# Altium project Final_Project_Layout.PrjPcb
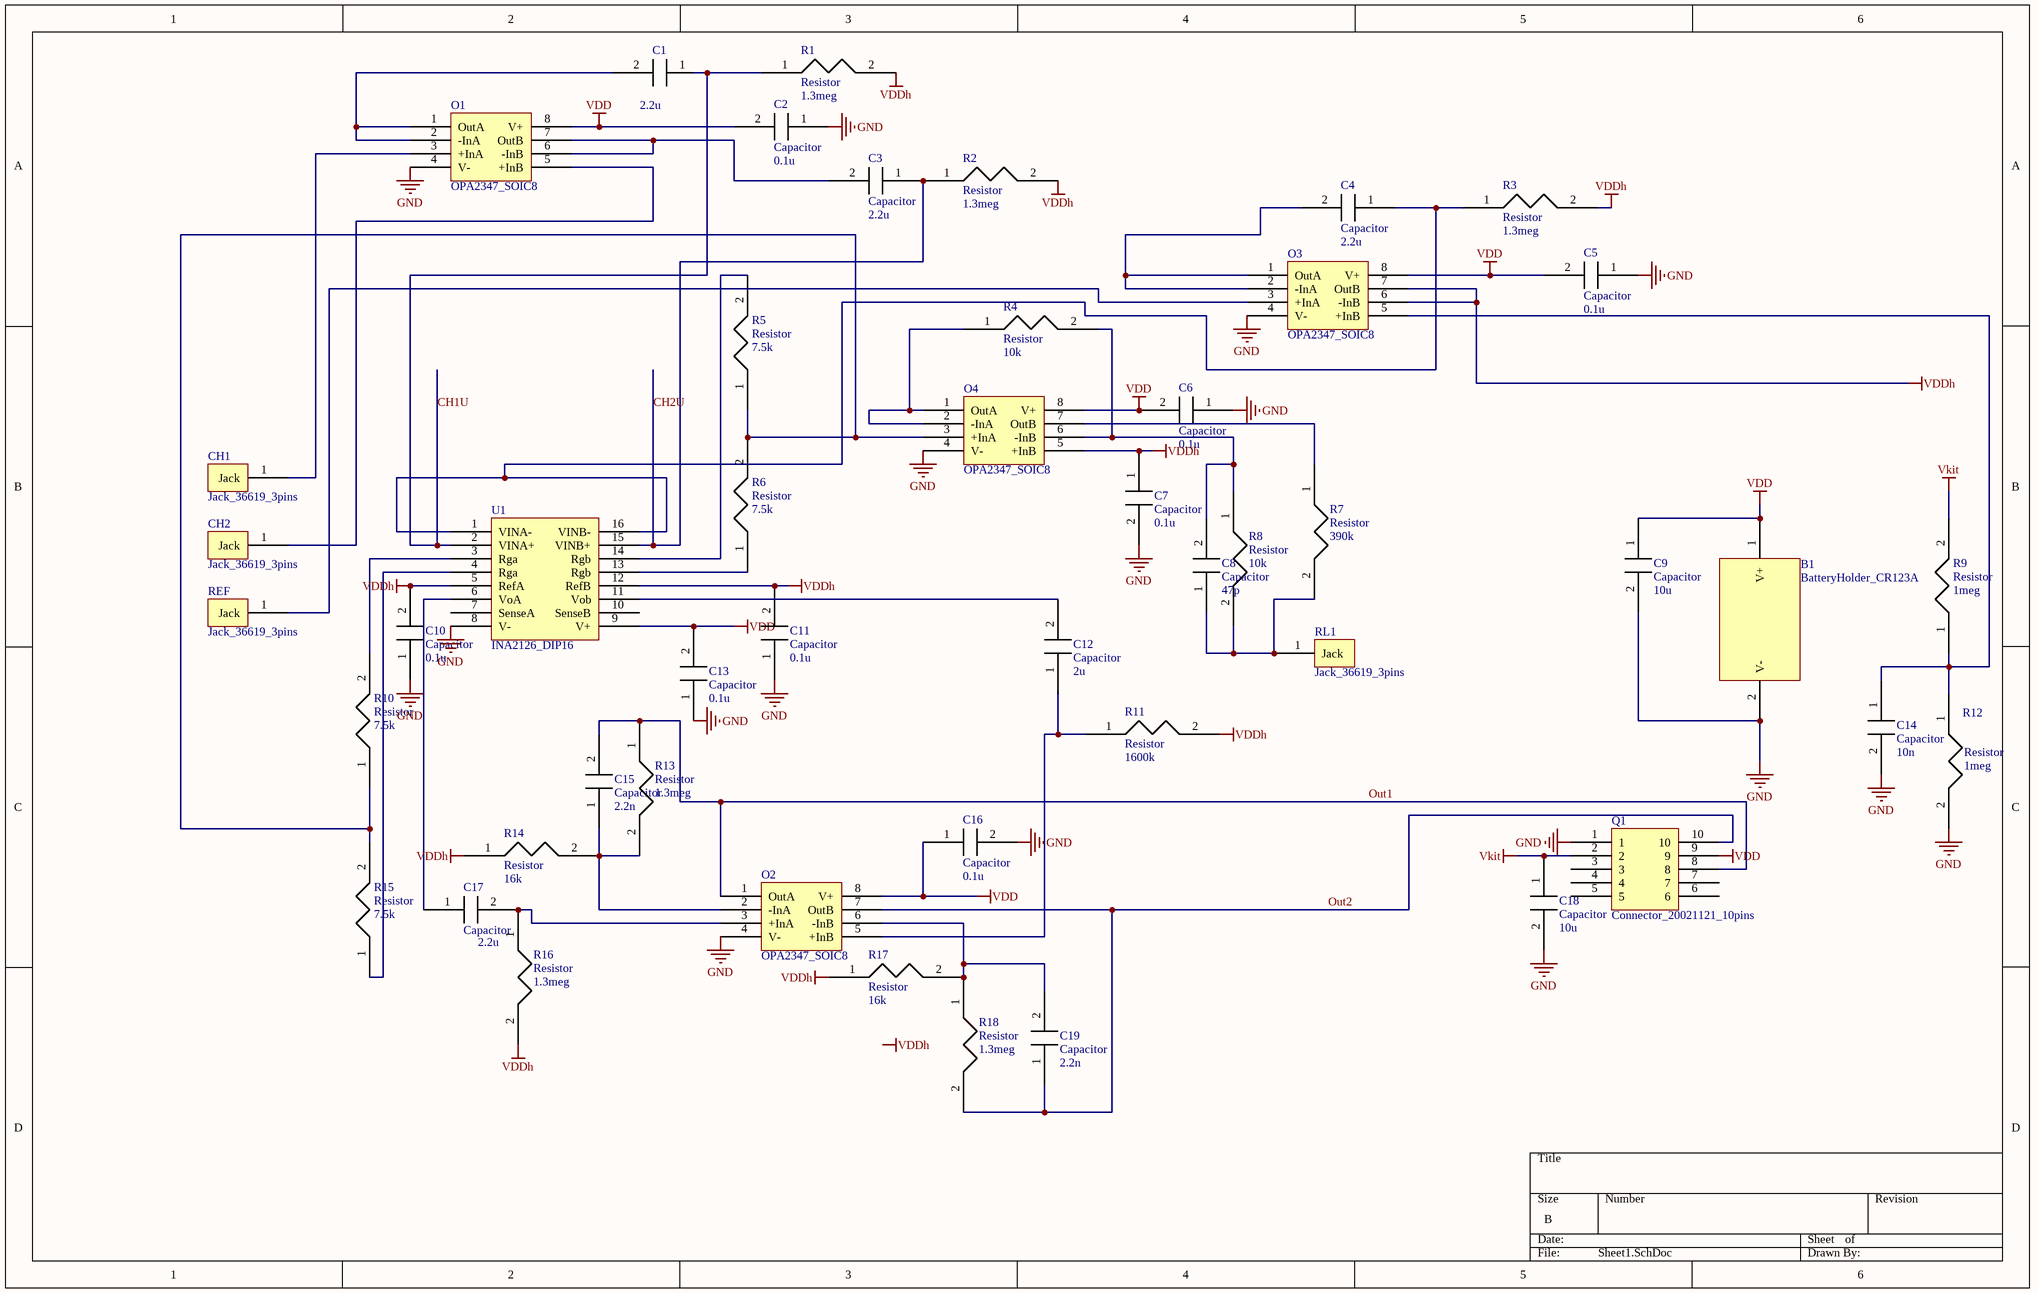
[diagram p0: Sheet1.SchDoc]
1 sheet, 48 parts. Net scope: global (net labels, ports and power ports of the same name join across sheets).
Board file: PCB3.PcbDoc

## Sheet Sheet1.SchDoc
size B

### Parts
B1  BatteryHolder_CR123A  [BatterHolder_CR123A]
C1  value 2.2u  [Capacitor]  (hidden comment: Capacitor)
C2  Capacitor  value 0.1u  [Capacitor]
C3  Capacitor  value 2.2u  [Capacitor]
C4  Capacitor  value 2.2u  [Capacitor]
C5  Capacitor  value 0.1u  [Capacitor]
C6  Capacitor  value 0.1u  [Capacitor]
C7  Capacitor  value 0.1u  [Capacitor]
C8  Capacitor  value 47p  [Capacitor]
C9  Capacitor  value 10u  [Capacitor]
C10  Capacitor  value 0.1u  [Capacitor]
C11  Capacitor  value 0.1u  [Capacitor]
C12  Capacitor  value 2u  [Capacitor]
C13  Capacitor  value 0.1u  [Capacitor]
C14  Capacitor  value 10n  [Capacitor]
C15  Capacitor  value 2.2n  [Capacitor]
C16  Capacitor  value 0.1u  [Capacitor]
C17  Capacitor  value 2.2u  [Capacitor]
C18  Capacitor  value 10u  [Capacitor]
C19  Capacitor  value 2.2n  [Capacitor]
CH1  Jack_36619_3pins  [Jack_36619_3pads]
CH2  Jack_36619_3pins  [Jack_36619_3pads]
O1  OPA2347_SOIC8  [OPA2347P_SOIC8]
O2  OPA2347_SOIC8  [OPA2347P_SOIC8]
O3  OPA2347_SOIC8  [OPA2347P_SOIC8]
O4  OPA2347_SOIC8  [OPA2347P_SOIC8]
Q1  Connector_20021121_10pins  [20021121-10pins]
R1  Resistor  value 1.3meg  [Resisitor]
R2  Resistor  value 1.3meg  [Resisitor]
R3  Resistor  value 1.3meg  [Resisitor]
R4  Resistor  value 10k  [Resisitor]
R5  Resistor  value 7.5k  [Resisitor]
R6  Resistor  value 7.5k  [Resisitor]
R7  Resistor  value 390k  [Resisitor]
R8  Resistor  value 10k  [Resisitor]
R9  Resistor  value 1meg  [Resisitor]
R10  Resistor  value 7.5k  [Resisitor]
R11  Resistor  value 1600k  [Resisitor]
R12  Resistor  value 1meg  [Resisitor]
R13  Resistor  value 1.3meg  [Resisitor]
R14  Resistor  value 16k  [Resisitor]
R15  Resistor  value 7.5k  [Resisitor]
R16  Resistor  value 1.3meg  [Resisitor]
R17  Resistor  value 16k  [Resisitor]
R18  Resistor  value 1.3meg  [Resisitor]
REF  Jack_36619_3pins  [Jack_36619_3pads]
RL1  Jack_36619_3pins  [Jack_36619_3pads]
U1  INA2126_DIP16  [INA2126_DIP16]

### Nets
GND: B1.2(V-) C2.1(V-) C5.1(V-) C6.1(V-) C7.2(V-) C9.2(V-) C10.1(V-) C11.1(V-) C13.1(V-) C14.2(V-) C16.2(V-) C18.2(V-) O1.4(V-) O2.4(V-) O3.4(V-) O4.4(V-) Q1.1 R12.2(V-) U1.8(V-)
VDD: B1.1(V+) C2.2(V-) C5.2(V-) C6.2(V-) C9.1(V-) C13.2(V-) C16.1(V-) O1.8(V+) O2.8(V+) O3.8(V+) O4.8(V+) Q1.9 U1.9(V+)
VDDh: C7.1(V-) C10.2(V-) C11.2(V-) O3.6(-InB) O3.7(OutB) O4.5(+InB) R1.2(V-) R2.2(V-) R3.2(V-) R11.2(V-) R14.1(V-) R16.2(V-) R17.1(V-) U1.5(RefA) U1.12(RefB)
Vkit: C18.1(V-) Q1.2 R9.2(V-)
CH1U: C1.1(V-) R1.1(V-) U1.2(VINA+)
CH2U: C3.1(V-) R2.1(V-) U1.15(VINB+)
Out1: C15.2(V-) O2.1(OutA) Q1.8 R13.1(V-)
Out2: C19.1(V-) O2.7(OutB) Q1.10 R18.2(V-)
NetC1_2: C1.2(V-) O1.1(OutA) O1.2(-InA)
NetC3_2: C3.2(V-) O1.6(-InB) O1.7(OutB)
NetC4_1: C4.1(V-) R3.1(V-) U1.1(VINA-) U1.16(VINB-)
NetC4_2: C4.2(V-) O3.1(OutA) O3.2(-InA)
NetC8_1: C8.1(V-) R7.2(V-) R8.2(V-) RL1.1(Jack)
NetC8_2: C8.2(V-) O4.6(-InB) R4.2(V-) R8.1(V-)
NetC12_1: C12.1(V-) O2.5(+InB) R11.1(V-)
NetC12_2: C12.2(V-) U1.11(Vob)
NetC14_1: C14.1(V-) O3.5(+InB) R9.1(V-) R12.1(V-)
NetC15_1: C15.1(V-) O2.2(-InA) R13.2(V-) R14.2(V-)
NetC17_1: C17.1(V-) U1.6(VoA)
NetC17_2: C17.2(V-) O2.3(+InA) R16.1(V-)
NetC19_2: C19.2(V-) O2.6(-InB) R17.2(V-) R18.1(V-)
NetCH1_1: CH1.1(Jack) O1.3(+InA)
NetCH2_1: CH2.1(Jack) O1.5(+InB)
NetO3_3: O3.3(+InA) REF.1(Jack)
NetO4_1: O4.1(OutA) O4.2(-InA) R4.1(V-)
NetO4_3: O4.3(+InA) R5.1(V-) R6.2(V-) R10.1(V-) R15.2(V-)
NetO4_7: O4.7(OutB) R7.1(V-)
NetR5_2: R5.2(V-) U1.14(Rgb)
NetR6_1: R6.1(V-) U1.13(Rgb)
NetR10_2: R10.2(V-) U1.3(Rga)
NetR15_1: R15.1(V-) U1.4(Rga)

Not connected (* = marked no-connect by the designer): Q1 3 4 5 6 7; U1 7(SenseA) 10(SenseB)

### Notes on the sheet
- Labels drawn without touching a wire or pin: VDDh